# EAGLE design Shruthi-Digital-v07 (EAGLE 5.11)
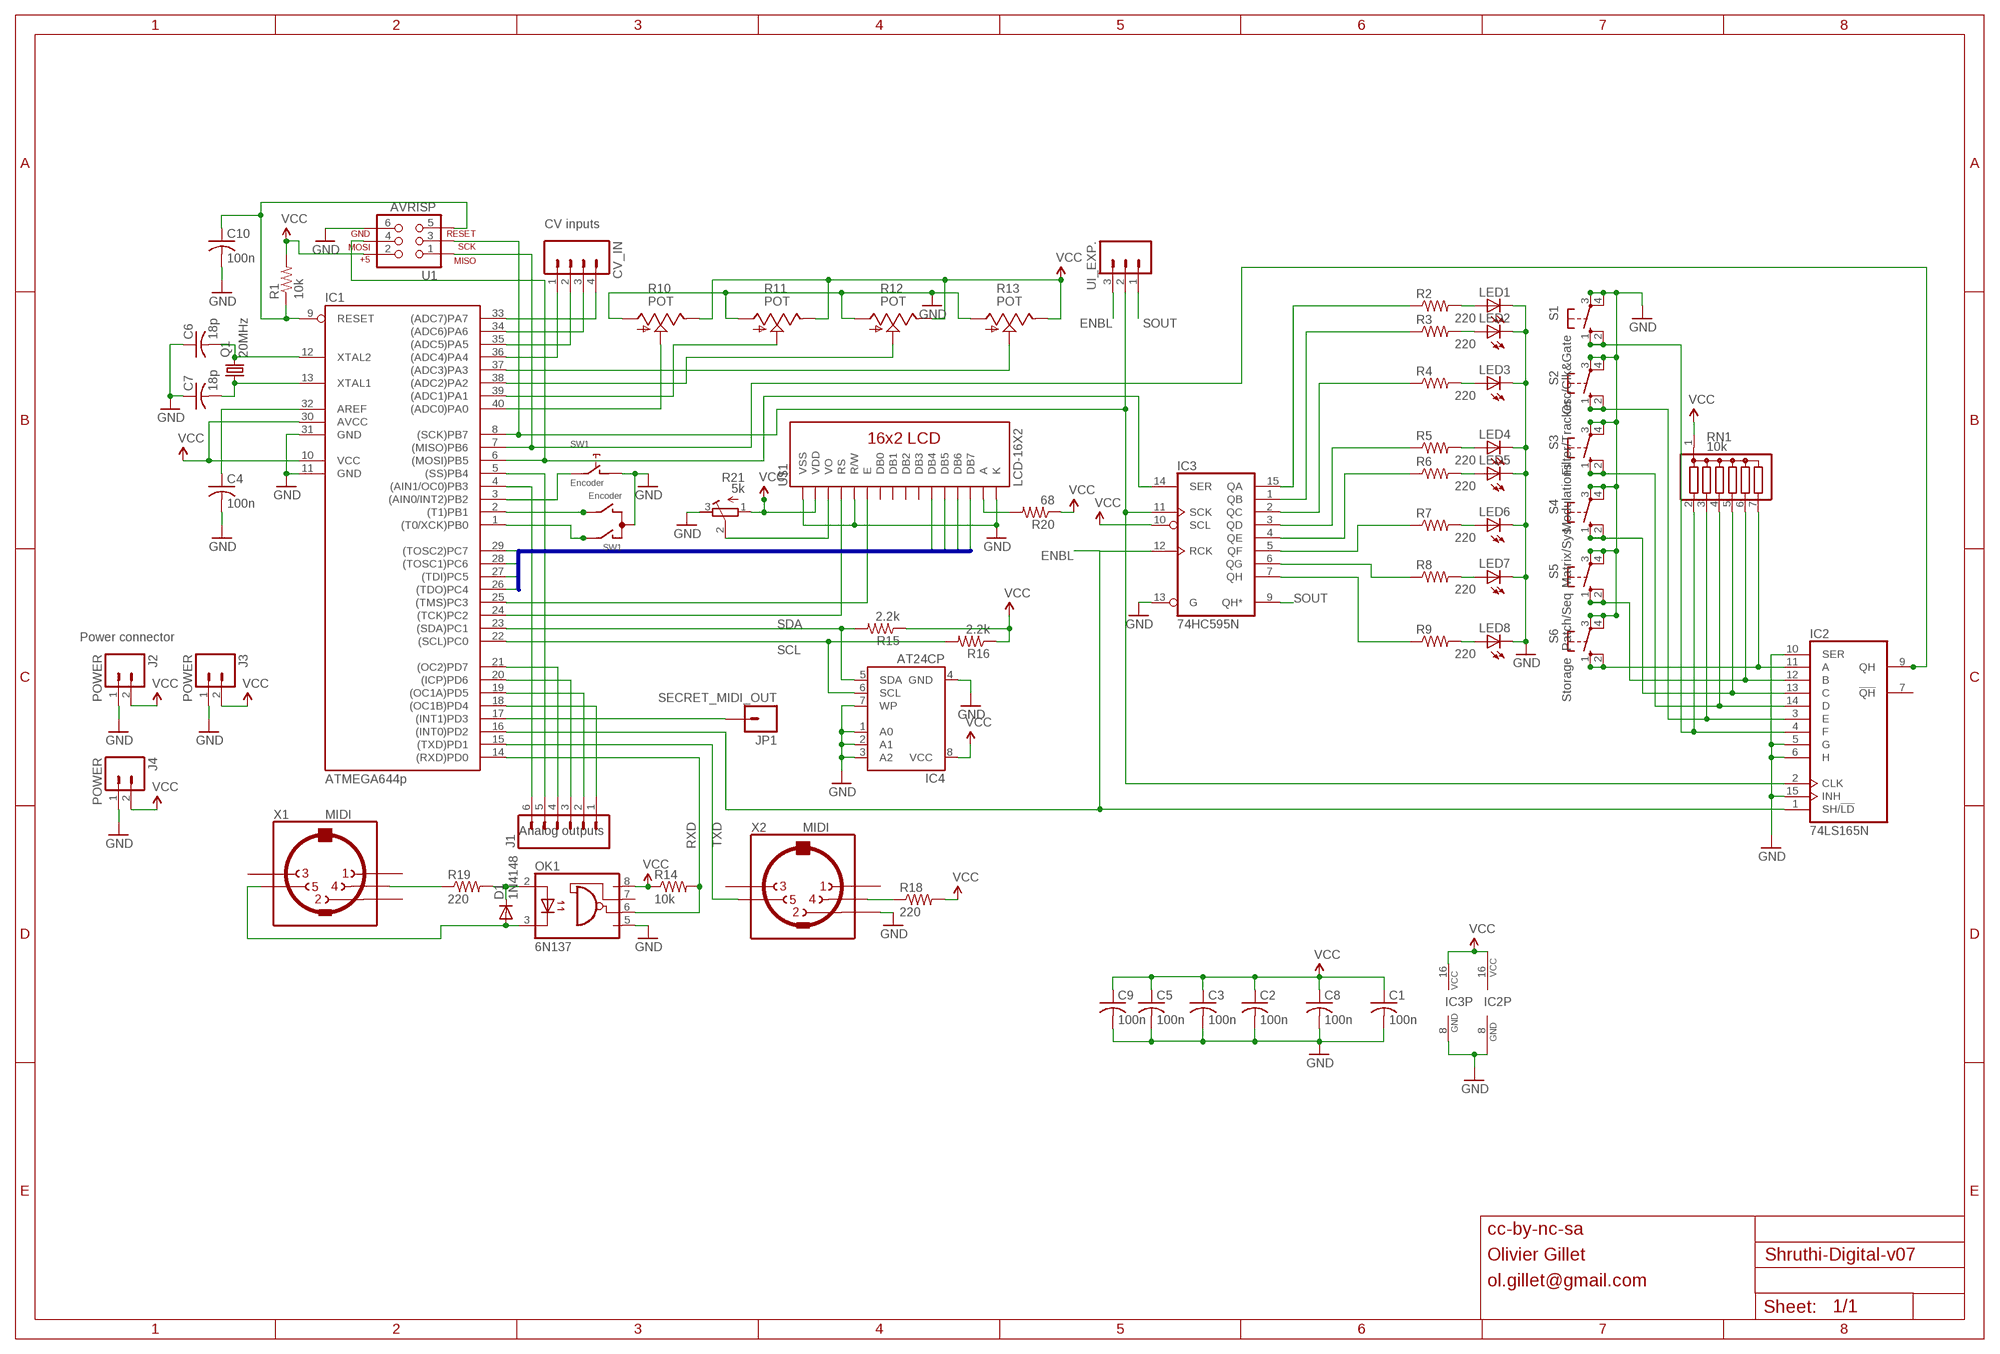
[diagram p0: schematic, sheet 1]

## Parts
C1  100n  C-US025-024X044  [C025-024X044]
C2  100n  C-US025-024X044  [C025-024X044]
C3  100n  C-US025-024X044  [C025-024X044]
C4  100n  C-US025-024X044  [C025-024X044]
C5  100n  C-US025-024X044  [C025-024X044]
C6  18p  C-US025-024X044  [C025-024X044]
C7  18p  C-US025-024X044  [C025-024X044]
C8  100n  C-US025-024X044  [C025-024X044]
C9  100n  C-US025-024X044  [C025-024X044]
C10  100n  C-US025-024X044  [C025-024X044]
CV_IN  M04PTH  [1X04]
D1  1N4148  DIODE-D-5  [D-5]
IC1  ATMEGA644p  MEGA16-P  [DIL40]
IC2  74LS165N  [DIL16]
IC3  74HC595N  [DIL16]
IC4  AT24CP  [DIL08]
J1  M06SIP  [1X06]
J2  POWER  M02PTH  [1X02]
J3  POWER  M02PTH  [1X02]
J4  POWER  M02PTH  [1X02]
JP1  SECRET_MIDI_OUT  M01PTH  [1X01]
LED1  LED3MM  [LED3MM]
LED2  LED3MM  [LED3MM]
LED3  LED3MM  [LED3MM]
LED4  LED3MM  [LED3MM]
LED5  LED3MM  [LED3MM]
LED6  LED3MM  [LED3MM]
LED7  LED3MM  [LED3MM]
LED8  LED3MM  [LED3MM]
OK1  6N137  [DIL08]
Q1  20MHz  CRYSTALHC49U-V  [HC49U-V]
R1  10k  R-US_0204/7  [0204/7]
R2  220  R-US_0204/7  [0204/7]
R3  220  R-US_0204/7  [0204/7]
R4  220  R-US_0204/7  [0204/7]
R5  220  R-US_0204/7  [0204/7]
R6  220  R-US_0204/7  [0204/7]
R7  220  R-US_0204/7  [0204/7]
R8  220  R-US_0204/7  [0204/7]
R9  220  R-US_0204/7  [0204/7]
R10  POT  POT_US  [ALPS_POT_SFE]
R11  POT  POT_US  [ALPS_POT_SFE]
R12  POT  POT_US  [ALPS_POT_SFE]
R13  POT  POT_US  [ALPS_POT_SFE]
R14  10k  R-US_0204/7  [0204/7]
R15  2.2k  R-US_0204/7  [0204/7]
R16  2.2k  R-US_0204/7  [0204/7]
R18  220  R-US_0204/7  [0204/7]
R19  220  R-US_0204/7  [0204/7]
R20  68  R-US_0204/7  [0204/7]
R21  5k  R-TRIMM3296W  [RTRIM3296W]
RN1  10k  G06R  [SIL7]
S1  Osc/Clk&Gate  40-XX  [B3F-40XX]
S2  Filter/Tracker  40-XX  [B3F-40XX]
S3  Modulations  40-XX  [B3F-40XX]
S4  Matrix/Sys  40-XX  [B3F-40XX]
S5  Patch/Seq  40-XX  [B3F-40XX]
S6  Storage  40-XX  [B3F-40XX]
SW1  Encoder  EC12E_SW  [ALPS_EC12E_SW]
U1  AVRISP  AVR_SPI_PRG_6PTH  [2X3]
U$1  LCD-16X2  [LCD-16X2]
UI_EXP.  M03PTH  [1X03]
X1  MIDI  MAB5SH  [MAB5SH]
X2  MIDI  MAB5SH  [MAB5SH]

## Nets
ENBL: IC1.16((INT0)PD2) IC2.1(SH/!LD) IC3.12(RCK) UI_EXP..3
GND: C1.2 C2.2 C3.2 C4.2 C5.2 C6.1 C7.1 C8.2 C9.2 C10.2 IC1.11(GND) IC1.31(GND) IC2.5(G) IC2.6(H) IC2.8(GND) IC2.10(SER) IC2.15(INH) IC3.8(GND) IC3.13(G) IC4.1(A0) IC4.2(A1) IC4.3(A2) IC4.4(GND) IC4.7(WP) J2.1 J3.1 J4.1 LED1.K(C) LED2.K(C) LED3.K(C) LED4.K(C) LED5.K(C) LED6.K(C) LED7.K(C) LED8.K(C) OK1.5(GND) R10.P$3(A) R11.P$3(A) R12.P$3(A) R13.P$3(A) R21.3(A) S1.3(P) S1.4(P1) S2.3(P) S2.4(P1) S3.3(P) S3.4(P1) S4.3(P) S4.4(P1) S5.3(P) S5.4(P1) S6.3(P) S6.4(P1) SW1.C SW1.D U1.6 U$1.1(VSS) U$1.5(R/W) U$1.16(K) X2.2
LCD_DATA1: IC1.26((TDO)PC4) U$1.11(DB4)
LCD_DATA2: IC1.27((TDI)PC5) U$1.12(DB5)
LCD_DATA3: IC1.28((TOSC1)PC6) U$1.13(DB6)
LCD_DATA4: IC1.29((TOSC2)PC7) U$1.14(DB7)
N$1: IC3.2(QC) R4.1
N$2: IC1.24((TCK)PC2) U$1.4(RS)
N$3: IC2.11(A) RN1.7 S6.1(S) S6.2(S1)
N$5: IC2.3(E) RN1.3 S2.1(S) S2.2(S1)
N$6: C10.1 IC1.9(RESET) R1.1 U1.5
N$7: C4.1 IC1.32(AREF)
N$8: IC1.8((SCK)PB7) IC2.2(CLK) IC3.11(SCK) U1.3 UI_EXP..2
N$9: IC1.7((MISO)PB6) IC2.9(QH) U1.1
N$10: CV_IN.1 IC1.36((ADC4)PA4)
N$11: CV_IN.2 IC1.35((ADC5)PA5)
N$12: CV_IN.3 IC1.34((ADC6)PA6)
N$13: CV_IN.4 IC1.33((ADC7)PA7)
N$14: IC1.40((ADC0)PA0) R10.P$2(S)
N$15: IC1.39((ADC1)PA1) R11.P$2(S)
N$16: IC1.38((ADC2)PA2) R12.P$2(S)
N$17: IC1.37((ADC3)PA3) R13.P$2(S)
N$18: IC1.4((AIN1/OC0)PB3) J1.6
N$19: IC1.5((SS)PB4) J1.5
N$20: IC1.18((OC1B)PD4) J1.1
N$21: IC1.19((OC1A)PD5) J1.2
N$22: IC1.20((ICP)PD6) J1.3
N$23: IC1.21((OC2)PD7) J1.4
N$25: IC1.17((INT1)PD3) JP1.1
N$28: D1.C OK1.2(A) R19.2
N$30: IC3.15(QA) R2.1
N$31: IC3.1(QB) R3.1
N$33: IC3.3(QD) R5.1
N$34: IC3.4(QE) R6.1
N$35: IC3.5(QF) R7.1
N$36: IC3.7(QH) R9.1
N$37: IC3.6(QG) R8.1
N$42: LED1.A R2.2
N$43: LED2.A R3.2
N$44: LED3.A R4.2
N$45: LED4.A R5.2
N$46: LED5.A R6.2
N$47: LED6.A R7.2
N$48: LED7.A R8.2
N$49: LED8.A R9.2
N$57: IC1.6((MOSI)PB5) IC3.14(SER) U1.4
N$59: IC2.4(F) RN1.2 S1.1(S) S1.2(S1)
N$61: IC2.14(D) RN1.4 S3.1(S) S3.2(S1)
N$62: IC2.13(C) RN1.5 S4.1(S) S4.2(S1)
N$63: IC2.12(B) RN1.6 S5.1(S) S5.2(S1)
N$64: IC1.1((T0/XCK)PB0) SW1.A
N$65: IC1.2((T1)PB1) SW1.B
N$66: IC1.3((AIN0/INT2)PB2) SW1.E
N$68: R18.1 X2.4
N$72: R19.1 X1.4
N$73: D1.A OK1.3(C) X1.5
N$76: IC1.25((TMS)PC3) U$1.6(E)
N$78: R21.2(S) U$1.3(VO)
N$79: R20.2 U$1.15(A)
N$82: C7.2 IC1.13(XTAL1) Q1.1
N$83: C6.2 IC1.12(XTAL2) Q1.2
RXD: IC1.14((RXD)PD0) OK1.6(VO) R14.2
SCL: IC1.22((SCL)PC0) IC4.6(SCL) R16.2
SDA: IC1.23((SDA)PC1) IC4.5(SDA) R15.2
SOUT: IC3.9(QH*) UI_EXP..1
TXD: IC1.15((TXD)PD1) X2.5
VCC: C1.1 C2.1 C3.1 C5.1 C8.1 C9.1 IC1.10(VCC) IC1.30(AVCC) IC2.16(VCC) IC3.10(SCL) IC3.16(VCC) IC4.8(VCC) J2.2 J3.2 J4.2 OK1.8(VCC) R1.2 R10.P$1(E) R11.P$1(E) R12.P$1(E) R13.P$1(E) R14.1 R15.1 R16.1 R18.2 R20.1 R21.1(E) RN1.1 U1.2 U$1.2(VDD)
Unconnected: IC2.7(!QH) OK1.7(VE) SW1.GND1(G) SW1.GND2(G) U$1.7(DB0) U$1.8(DB1) U$1.9(DB2) U$1.10(DB3) X1.1 X1.2 X1.3 X2.1 X2.3

## Buses
LCD_DATA[1..4]

## Notes on the sheet
- CV inputs
- Power connector
- Analog outputs
- cc-by-nc-sa
- Olivier Gillet
- ol.gillet@gmail.com

## Library data of the parts
C1-C10 = rcl:C-US: CAPACITOR, American symbol
CV_IN = SparkFun:M04: Header 4 Standard 4-pin 0.1" header. Use with straight break away headers (SKU : PRT-00116), right angle break away headers (PRT-00553), swiss pins (PRT-00743), machine pins (PRT-00117), and female headers (PRT-00115). Molex polarized connector foot print use with SKU : PRT-08231 with associated crimp pins and housings.
D1 = diode:DIODE-: DIODE
IC1 = atmel:MEGA16-P: MICROCONTROLLER 16 Kbytes FLASH 1 kbytes SRAM 512 bytes EEPROM USART 8-channel 10 bit ADC Source: avr.lbr
IC2 = 74xx-us:74*165: 8-bit parallel load SHIFT REGISTER
IC3 = 74xx-eu:74*595: 8-bit SHIFT REGISTER, output latch
IC4 = atmel:AT24C*: 2-wire serial EEPROM
J1 = SparkFun:M06: Header 6 Standard 6-pin 0.1" header. Use with straight break away headers (SKU : PRT-00116), right angle break away headers (PRT-00553), swiss pins (PRT-00743), machine pins (PRT-00117), and female headers (PRT-00115). Molex polarized connector foot print use with SKU : PRT-08094 with associated crimp pins and housings. NOTES ON THE VARIANTS LOCK and LOCK_LONGPADS... This footprint was designed to help hold the alignment of a through-hole component (i.e. 6-pin header) while soldering it into place. You may notice that each hole has been shifted either up or down by 0.005 of an inch from it's more standard position (which is a perfectly straight line). This slight alteration caused the pins (the squares in the middle) to touch the edges of the holes. Because they are alternating, it causes a "brace" to hold the component in place. 0.005 has proven to be the perfect amount of "off-center" position when using our standard breakaway headers. Although looks a little odd when you look at the bare footprint, once you have a header in there, the alteration is very hard to notice. Also, if you push a header all the way into place, it is covered up entirely on the bottom side. This idea of altering the position of holes to aid alignment will be further integrated into the Sparkfun Library for other footprints. It can help hold any component with 3 or more connection pins.
J2-J4 = SparkFun:M02: Header 2 Standard 2-pin 0.1" header. Use with straight break away headers (SKU : PRT-00116), right angle break away headers (PRT-00553), swiss pins (PRT-00743), machine pins (PRT-00117), and female headers (PRT-00115). Molex polarized connector foot print use with SKU : PRT-08233 with associated crimp pins and housings.
JP1 = SparkFun:M01: Header 1 Standard 1-pin 0.1" header. Use with straight break away headers (SKU : PRT-00116), right angle break away headers (PRT-00553), swiss pins (PRT-00743), machine pins (PRT-00117), and female headers (PRT-00115).
LED1-LED8 = led:LED: LED OSRAM: - CHIPLED LG R971, LG N971, LY N971, LG Q971, LY Q971, LO R971, LY R971 LH N974, LH R974 LS Q976, LO Q976, LY Q976 LO Q996 - Hyper CHIPLED LW Q18S LB Q993, LB Q99A, LB R99A - SideLED LS A670, LO A670, LY A670, LG A670, LP A670 LB A673, LV A673, LT A673, LW A673 LH A674 LY A675 LS A676, LA A676, LO A676, LY A676, LW A676 LS A679, LY A679, LG A679 - Hyper Micro SIDELED® LS Y876, LA Y876, LO Y876, LY Y876 LT Y87S - SmartLED LW L88C, LW L88S LB L89C, LB L89S, LG L890 LS L89K, LO L89K, LY L89K LS L896, LA L896, LO L896, LY L896 - TOPLED LS T670, LO T670, LY T670, LG T670, LP T670 LSG T670, LSP T670, LSY T670, LOP T670, LYG T670 LG T671, LOG T671, LSG T671 LB T673, LV T673, LT T673, LW T673 LH T674 LS T676, LA T676, LO T676, LY T676, LB T676, LH T676, LSB T676, LW T676 LB T67C, LV T67C, LT T67C, LS T67K, LO T67K, LY T67K, LW E67C LS E67B, LA E67B, LO E67B, LY E67B, LB E67C, LV E67C, LT E67C LW T67C LS T679, LY T679, LG T679 LS T770, LO T770, LY T770, LG T770, LP T770 LB T773, LV T773, LT T773, LW T773 LH T774 LS E675, LA E675, LY E675, LS T675 LS T776, LA T776, LO T776, LY T776, LB T776 LHGB T686 LT T68C, LB T68C - Hyper Mini TOPLED® LB M676 - Mini TOPLED Santana® LG M470 LS M47K, LO M47K, LY M47K Source: http://www.osram.convergy.de LUXEON: - LUMILED® LXK2-PW12-R00, LXK2-PW12-S00, LXK2-PW14-U00, LXK2-PW14-V00 LXK2-PM12-R00, LXK2-PM12-S00, LXK2-PM14-U00 LXK2-PE12-Q00, LXK2-PE12-R00, LXK2-PE12-S00, LXK2-PE14-T00, LXK2-PE14-U00 LXK2-PB12-K00, LXK2-PB12-L00, LXK2-PB12-M00, LXK2-PB14-N00, LXK2-PB14-P00, LXK2-PB14-Q00 LXK2-PR12-L00, LXK2-PR12-M00, LXK2-PR14-Q00, LXK2-PR14-R00 LXK2-PD12-Q00, LXK2-PD12-R00, LXK2-PD12-S00 LXK2-PH12-R00, LXK2-PH12-S00 LXK2-PL12-P00, LXK2-PL12-Q00, LXK2-PL12-R00 Source: www.luxeon.com KINGBRIGHT: KA-3528ASYC Source: www.kingbright.com
OK1 = optocoupler:6N137: MOTOROLA OPTO COUPLER
Q1 = crystal:CRYSTAL: CRYSTAL
R1-R9 R14-R16 R18-R20 = rcl:R-US_: RESISTOR, American symbol
R10-R13 = pot-alps:POT_US
R21 = rcl:R-TRIMM: Trimm resistor
RN1 = resistor-sil:G06R: SIL RESISTOR
S1-S6 = og-switch:40-XX: OMRON SWITCH
SW1 = switch-alps:EC12E_SW: ALPS rotary Encoder EC12E series with switch
U1 = SparkFun:AVR_SPI_PRG_6: AVR ISP 6 Pin This is the reduced ISP connector for AVR programming. Common on Arduino. This footprint will take up less PCB space and can be used with a 10-pin to 6-pin adapter such as SKU: BOB-08508
U$1 = SparkFun:LCD-16X2
UI_EXP. = SparkFun:M03: Header 3 Standard 3-pin 0.1" header. Use with straight break away headers (SKU : PRT-00116), right angle break away headers (PRT-00553), swiss pins (PRT-00743), machine pins (PRT-00117), and female headers (PRT-00115). Molex polarized connector foot print use with SKU : PRT-08232 with associated crimp pins and housings.
X1 X2 = og-midi:MAB5SH: Female CONNECTOR 5 pins 90 deg. with shield, horizontal (DIN 41524)

## Board
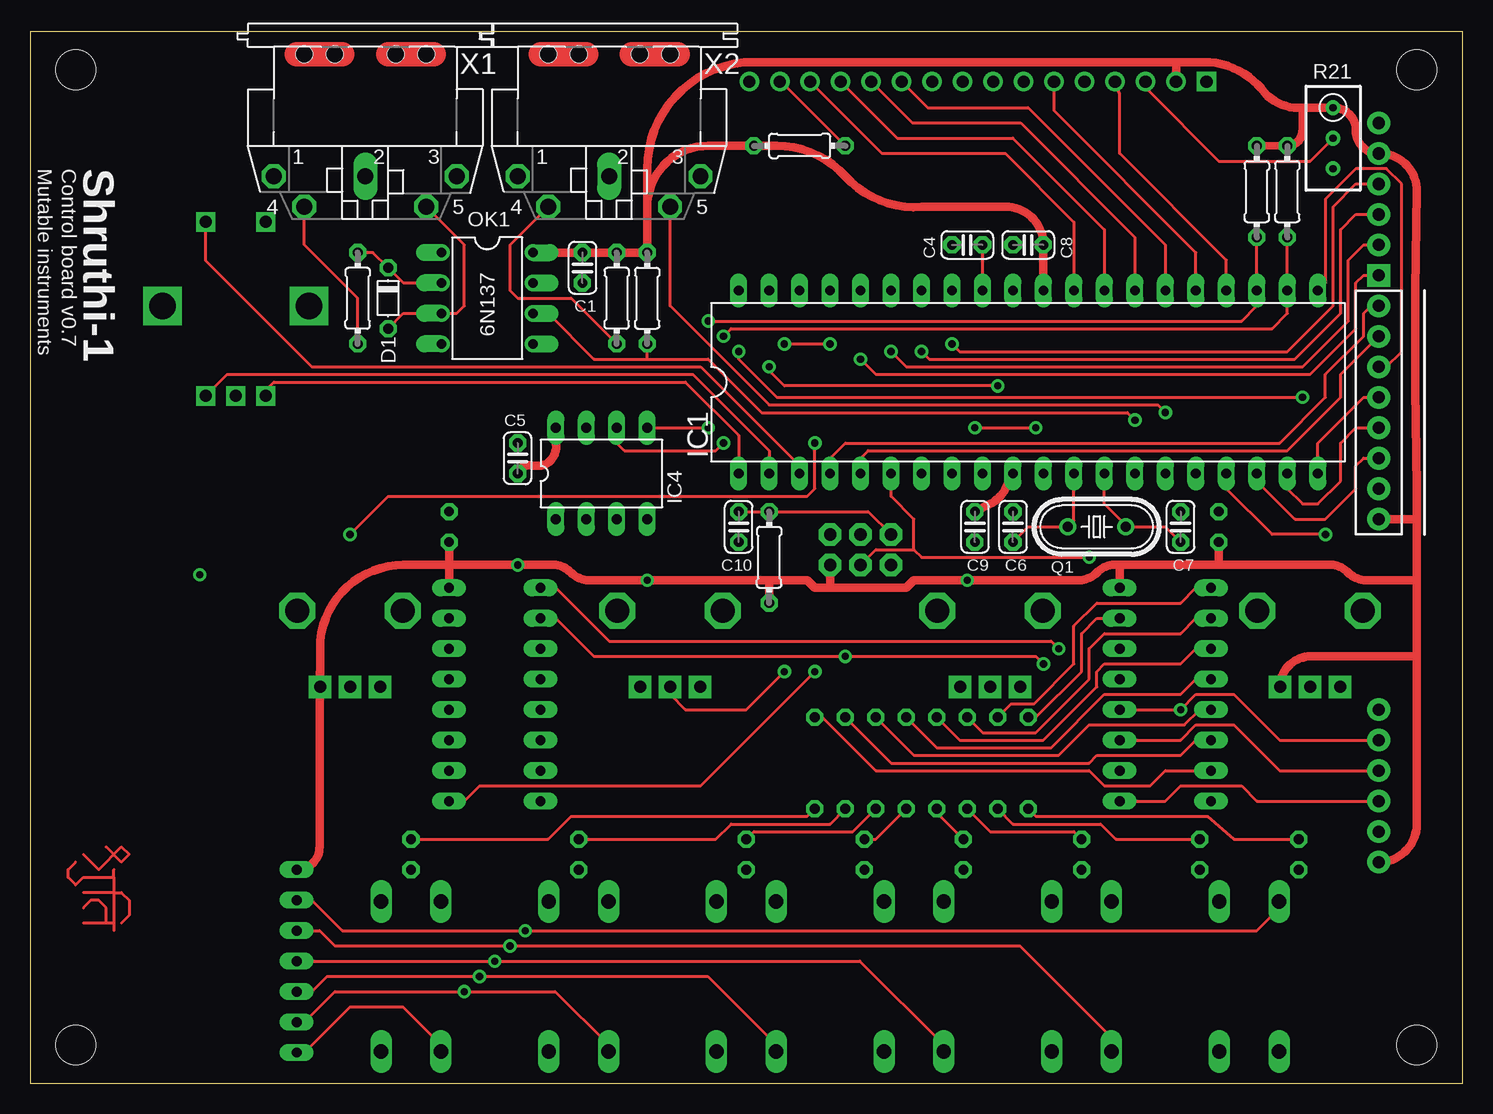
[diagram p1: board, top side]
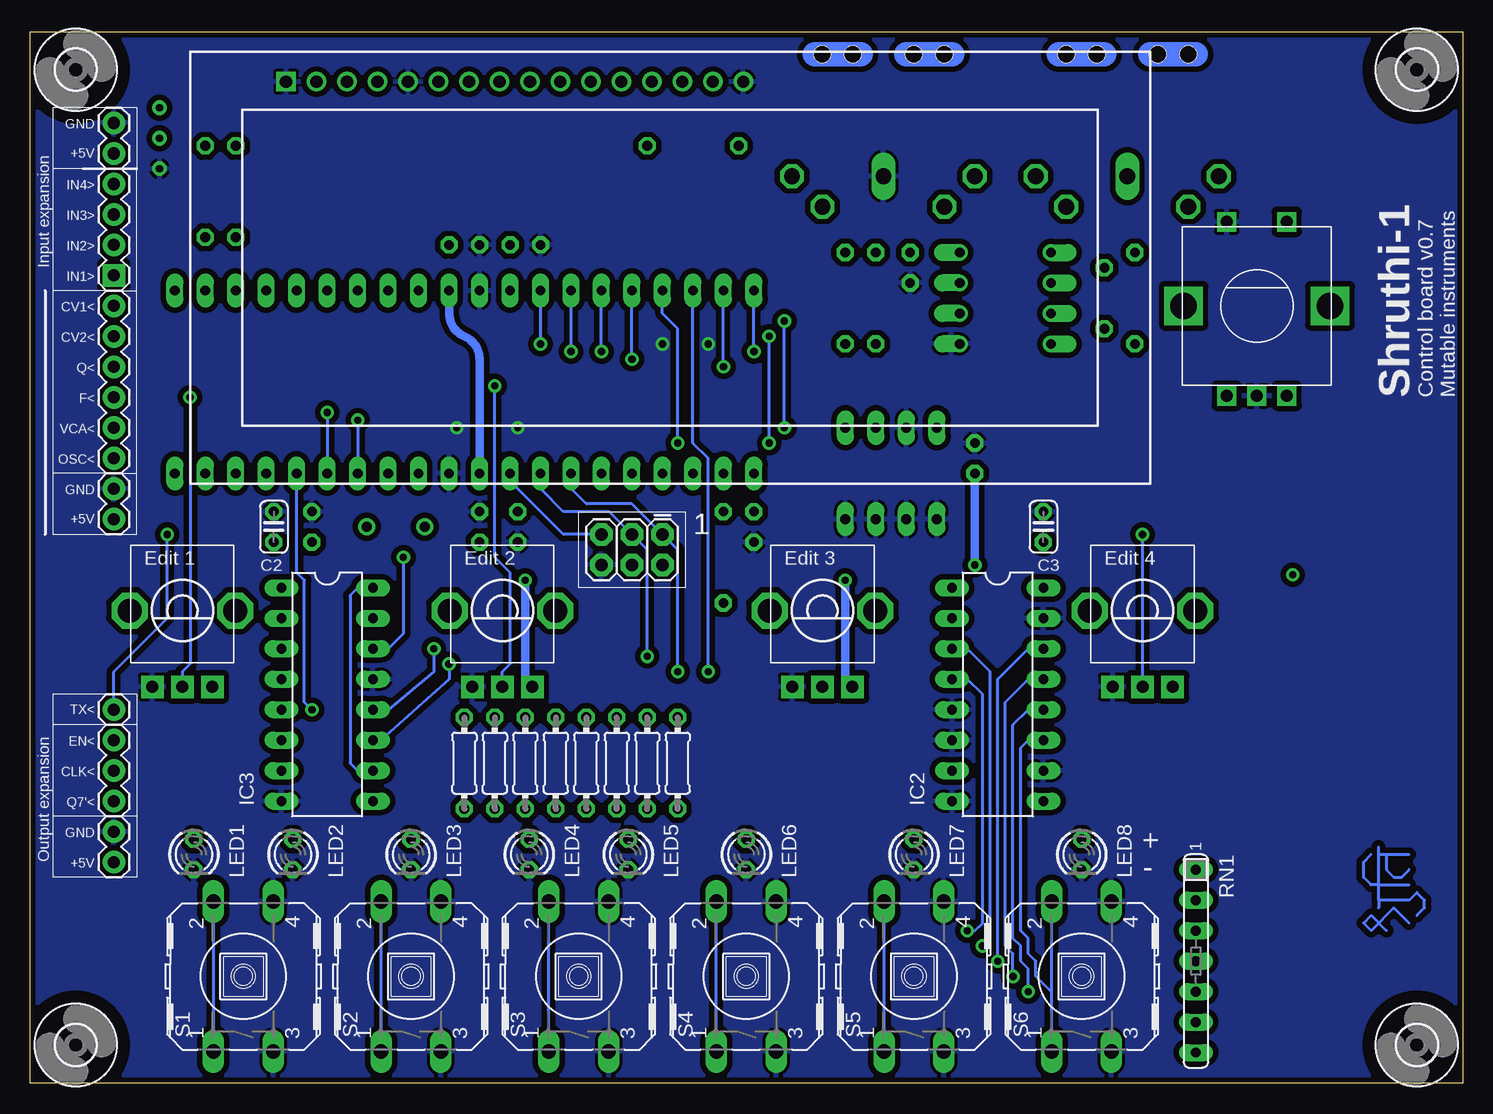
[diagram p2: board, bottom side, seen from below]

Size 119.38 x 87.63 mm. Coordinates in mm from the lower left corner, seen from the top.
Outline: 0,0 119.38,0 119.38,87.63 0,87.62 0,0
Copper layers (1*16): Top 0.035mm / dielectric 1.5mm / Bottom 0.035mm
Design rules "SparkFun *": minimum track width 8mil, minimum drill 20mil, track to track 8mil, track to pad 8mil, pad to pad 8mil, via to via 8mil, smd to smd 8mil, copper to edge 10mil, drill to drill 8mil, minimum pad ring 12mil, minimum via ring 10mil, stop-mask expansion 4mil, vias tented up to drill 25mil, thermal gap 10mil

### Footprints (pad centres in the part's own frame; a part is rotated, then mirrored left to right if it is on the bottom)
C025-024X044 = drill 0.813 octagon: 1 -1.27,0; 2 1.27,0
1X04 = drill 1.016 pad 1.88 square: 1 0,0 | drill 1.016 pad 1.88 round: 2 2.54,0; 3 5.08,0; 4 7.62,0
D-5 = drill 0.813 octagon: A 2.54,0; C -2.54,0
DIL40 = drill 0.813 long: 1 -24.13,-7.62; 2 -21.59,-7.62; 3 -19.05,-7.62; 4 -16.51,-7.62; 5 -13.97,-7.62; 6 -11.43,-7.62; 7 -8.89,-7.62; 8 -6.35,-7.62; 9 -3.81,-7.62; 10 -1.27,-7.62; 11 1.27,-7.62; 12 3.81,-7.62; 13 6.35,-7.62; 14 8.89,-7.62; 15 11.43,-7.62; 16 13.97,-7.62; 17 16.51,-7.62; 18 19.05,-7.62; 19 21.59,-7.62; 20 24.13,-7.62; 21 24.13,7.62; 22 21.59,7.62; 23 19.05,7.62; 24 16.51,7.62; 25 13.97,7.62; 26 11.43,7.62; 27 8.89,7.62; 28 6.35,7.62; 29 3.81,7.62; 30 1.27,7.62; 31 -1.27,7.62; 32 -3.81,7.62; 33 -6.35,7.62; 34 -8.89,7.62; 35 -11.43,7.62; 36 -13.97,7.62; 37 -16.51,7.62; 38 -19.05,7.62; 39 -21.59,7.62; 40 -24.13,7.62
DIL16 = drill 0.813 long: 1 -8.89,-3.81; 2 -6.35,-3.81; 3 -3.81,-3.81; 4 -1.27,-3.81; 5 1.27,-3.81; 6 3.81,-3.81; 7 6.35,-3.81; 8 8.89,-3.81; 9 8.89,3.81; 10 6.35,3.81; 11 3.81,3.81; 12 1.27,3.81; 13 -1.27,3.81; 14 -3.81,3.81; 15 -6.35,3.81; 16 -8.89,3.81
DIL08 = drill 0.813 long: 1 -3.81,-3.81; 2 -1.27,-3.81; 3 1.27,-3.81; 4 3.81,-3.81; 5 3.81,3.81; 6 1.27,3.81; 7 -1.27,3.81; 8 -3.81,3.81
1X06 = drill 1.016 pad 1.88 round: 1 0,0; 2 2.54,0; 3 5.08,0; 4 7.62,0; 5 10.16,0; 6 12.7,0
1X02 = drill 1.016 pad 1.88 round: 1 0,0; 2 2.54,0
1X01 = drill 1.016 pad 1.88 round: 1 0,0
LED3MM = drill 0.813 octagon: A -1.27,0; K 1.27,0
DIL08' = drill 0.813 offset: 1 -3.81,-3.81; 2 -1.27,-3.81; 3 1.27,-3.81; 4 3.81,-3.81; 5 3.81,3.81; 6 1.27,3.81; 7 -1.27,3.81; 8 -3.81,3.81
HC49U-V = drill 0.813 round: 1 -2.413,0; 2 2.413,0
0204/7 = drill 0.813 octagon: 1 -3.81,0; 2 3.81,0
ALPS_POT_SFE = drill 1 pad 1.88 square: P$1 -2.5,6.35; P$2 0,6.35; P$3 2.5,6.35 | drill 2 octagon: P$4 -4.4,0; P$5 4.4,0
RTRIM3296W = drill 0.61 round: 1 0,-2.54; 2 0,0; 3 0,2.54
SIL7 = drill 0.813 long: 1 -7.62,0; 2 -5.08,0; 3 -2.54,0; 4 0,0; 5 2.54,0; 6 5.08,0; 7 7.62,0
B3F-40XX = drill 1.194 long: 1 -6.248,2.489; 2 6.248,2.489; 3 -6.248,-2.489; 4 6.248,-2.489
ALPS_EC12E_SW = drill 1 square: A -2.5,-7.5; B 2.5,-7.5; C 0,-7.5; D -2.5,7; E 2.5,7 | drill 2.2 square: GND1 -6.1,0; GND2 6.1,0
2X3 = drill 1.016 pad 1.88 octagon: 1 0,0; 2 0,2.54; 3 2.54,0; 4 2.54,2.54; 5 5.08,0; 6 5.08,2.54
LCD-16X2 = drill 1.016 square: 1 -32,15.5 | drill 1.016 round: 2 -29.46,15.5; 3 -26.92,15.5; 4 -24.38,15.5; 5 -21.84,15.5; 6 -19.3,15.5; 7 -16.76,15.5; 8 -14.22,15.5; 9 -11.68,15.5; 10 -9.14,15.5; 11 -6.6,15.5; 12 -4.06,15.5; 13 -1.52,15.5; 14 1.02,15.5; 15 3.56,15.5; 16 6.1,15.5
3,3 = hole 3.3: 0,0
1X03 = drill 1.016 pad 1.88 round: 1 0,0; 2 2.54,0; 3 5.08,0
MAB5SH = drill 1.321 octagon: 1 7.62,7.62; 3 -7.62,7.62; 4 5.08,10.16; 5 -5.08,10.16 | drill 1.321 long: 2 0,7.62 | hole 1.4: 2.54,-2.54; -2.54,-2.54; -5.08,-2.54; 5.08,-2.54

### Placement (x,y rotation side)
C1  46.04,67.95 270 top
C2  99.06,46.35 90 bottom
C3  34.92,46.35 90 bottom
C4  78.11,69.85 180 top
C5  40.64,52.07 90 top
C6  81.92,46.35 270 top
C7  95.89,46.35 270 top
C8  83.19,69.85 180 top
C9  78.74,46.35 270 top
C10  59.05,46.35 270 top
CV_IN  112.39,67.31 90 bottom
D1  29.84,65.41 270 top
IC1  83.19,58.42 0 top
IC2  38.73,32.38 270 bottom
IC3  94.61,32.38 270 bottom
IC4  47.62,50.8 0 top
J1  112.39,52.07 90 bottom
J2  112.39,49.53 270 bottom
J3  112.39,80.01 270 bottom
J4  112.39,20.95 270 bottom
JP1  112.39,31.11 90 bottom
LED1  105.73,19.05 270 bottom
LED2  97.47,19.05 270 bottom
LED3  87.63,19.05 270 bottom
LED4  77.79,19.05 270 bottom
LED5  69.53,19.05 270 bottom
LED6  59.69,19.05 270 bottom
LED7  45.72,19.05 270 bottom
LED8  31.75,19.05 270 bottom
OK1  6N137  [DIL08']  38.1,65.41 270 top
Q1  88.9,46.35 180 top
R1  61.59,43.81 270 top
R2  83.19,26.67 270 bottom
R3  80.64,26.67 270 bottom
R4  78.11,26.67 270 bottom
R5  75.56,26.67 270 bottom
R6  73.02,26.67 270 bottom
R7  70.48,26.67 270 bottom
R8  67.94,26.67 270 bottom
R9  65.41,26.67 270 bottom
R10  106.68,39.37 180 bottom
R11  80.01,39.37 180 bottom
R12  53.34,39.37 180 bottom
R13  26.67,39.37 180 bottom
R14  51.44,65.41 270 top
R15  102.23,74.3 270 top
R16  104.78,74.3 270 top
R18  48.9,65.41 90 top
R19  27.3,65.41 90 top
R20  64.14,78.11 0 top
R21  108.59,78.74 180 top
RN1  22.23,10.16 270 bottom
S1  101.6,8.89 90 bottom
S2  87.63,8.89 90 bottom
S3  73.66,8.89 90 bottom
S4  59.69,8.89 90 bottom
S5  45.72,8.89 90 bottom
S6  31.75,8.89 90 bottom
SW1  17.14,64.77 0 bottom
U1  66.67,45.72 180 bottom
U$1  66.04,67.95 0 bottom
U$2  [3,3]  115.57,84.46 0 bottom
U$3  [3,3]  115.57,3.17 0 bottom
U$4  [3,3]  3.81,3.17 0 bottom
U$5  [3,3]  3.81,84.46 0 bottom
UI_EXP.  112.39,23.49 90 bottom
X1  27.94,83.19 180 top
X2  48.26,83.19 180 top

### Tracks (layer width: path | path; a pad name or v marks a point on that pad's centre or on a via)
ENBL  (via drill 0.6)
  Top 0.254: IC3.12 v95.89,31.11 97.16,32.38 100.33,32.38 104.14,28.57 UI_EXP..3 | IC2.1 43.82,41.27 48.26,36.83 85.09,36.83 v85.73,36.2
  Bottom 0.254: v95.89,31.11 96.52,31.75 96.52,41.91 97.16,42.55 IC1.16 | v85.73,36.2 85.73,34.29 89.53,31.11 IC3.12
GND  (via drill 0.6)
  Top 0.254: v62.87,61.59 v66.67,61.59 | v78.74,54.61 v83.82,54.61
  pour Bottom (isolate 0.457): 0.63,87 0.63,0.64 118.75,0.64 118.75,87
LCD_DATA1
  Top 0.254: U$1.11 74.81,81.28 83.19,81.28 94.61,69.85 IC1.26
LCD_DATA2
  Top 0.254: U$1.12 73.53,80.01 82.55,80.01 92.08,70.48 IC1.27
LCD_DATA3
  Top 0.254: U$1.13 72.27,78.74 81.92,78.74 89.53,71.12 IC1.28
LCD_DATA4
  Top 0.254: U$1.14 71,77.47 81.28,77.47 87,71.76 IC1.29
N$1
  Top 0.254: R4.1 79.38,29.21 83.82,29.21 88.27,33.66 88.27,36.2 89.53,37.46 95.89,37.46 97.16,38.73 IC3.2
N$2
  Top 0.254: IC1.24 99.7,68.58 90.81,77.47 90.81,82.43 U$1.4
N$3
  Top 0.254: S6.1 34.24,3.17 31.06,6.35 26.67,6.35 22.86,2.54 RN1.7
  Bottom 0.254: S6.1 34.24,7.62 | 34.24,7.62 S6.2 34.24,15.19 | IC2.11 36.2,28.57 36.83,27.94 36.83,12.7 36.2,12.07 36.2,10.8 35.56,10.16 35.56,8.89 34.29,7.62 34.24,7.62
N$4
  Top 0.254: 4.45,19.05 5.71,17.78 7.62,19.68 8.25,19.05 7.62,18.41 6.35,19.68
N$5  (via drill 0.6)
  Top 0.254: S2.1 90.12,3.81 82.5,11.43 v40.01,11.43 25.4,11.43 24.13,12.7 RN1.3
  Bottom 0.254: S2.1 S2.2 | IC2.3 41.27,36.2 39.37,34.29 39.37,12.07 v40.01,11.43
N$6
  Top 0.254: U1.5 69.85,47.62 R1.1 C10.1
  Bottom 0.254: U1.5 74.93,45.72 79.38,50.16 IC1.9
N$7
  Top 0.254: IC1.32 C4.1
N$8  (via drill 0.6)
  Top 0.254: v84.45,34.92 83.82,35.56 v67.94,35.56 46.99,35.56 43.82,38.73 IC2.2 | IC3.11 95.89,28.57 97.16,29.84 100.33,29.84 104.14,26.04 UI_EXP..2
  Bottom 0.254: IC3.11 90.17,28.57 84.45,33.66 v84.45,34.92 | IC1.8 76.84,49.53 74.93,47.62 71.12,47.62 U1.3 67.94,44.45 v67.94,35.56
N$9  (via drill 0.6)
  Top 0.254: v65.41,34.29 55.88,24.77 37.47,24.77 36.2,23.49 IC2.9
  Bottom 0.254: v65.41,34.29 65.41,44.45 U1.1 69.22,48.26 73.02,48.26 74.3,49.53 IC1.7
N$10  (via drill 0.6)
  Top 0.254: CV_IN.1 111.12,67.31 110.49,66.68 110.49,62.87 106.68,59.05 70.48,59.05 v69.22,60.32
  Bottom 0.254: v69.22,60.32 IC1.36
N$11  (via drill 0.6)
  Top 0.254: CV_IN.2 111.12,69.85 109.86,68.58 109.86,63.5 106.05,59.69 73.02,59.69 v71.75,60.96
  Bottom 0.254: v71.75,60.96 IC1.35
N$12  (via drill 0.6)
  Top 0.254: CV_IN.3 110.49,72.39 109.22,71.12 109.22,64.14 105.41,60.32 74.93,60.32 v74.3,60.96
  Bottom 0.254: v74.3,60.96 IC1.34
N$13  (via drill 0.6)
  Top 0.254: CV_IN.4 110.49,74.93 108.59,73.03 108.59,64.77 104.78,60.96 77.47,60.96 v76.84,61.59
  Bottom 0.254: v76.84,61.59 IC1.33
N$14  (via drill 0.6)
  Top 0.254: v106.05,57.15 62.23,57.15 59.05,60.32 v59.05,60.96
  Bottom 0.254: v106.05,57.15 106.05,34.92 106.68,34.29 R10.P$2 | v59.05,60.96 IC1.40
N$15  (via drill 0.6)
  Top 0.254: v80.64,58.1 62.87,58.1 61.59,59.37 v61.59,59.69
  Bottom 0.254: v80.64,58.1 80.64,43.81 79.38,42.55 79.38,34.92 80.01,34.29 R11.P$2 | v61.59,59.69 IC1.39
N$16  (via drill 0.6)
  Top 0.254: R12.P$2 53.34,32.38 54.61,31.11 59.69,31.11 v62.87,34.29
  Bottom 0.254: IC1.38 64.14,53.34 62.87,52.07 v62.87,34.29
N$17  (via drill 0.6)
  Top 0.254: v26.67,45.72 29.84,48.89 64.77,48.89 65.41,49.53 v65.41,53.34
  Bottom 0.254: R13.P$2 v26.67,45.72 | IC1.37 66.67,64.14 65.41,62.87 v65.41,53.34
N$18
  Top 0.254: IC1.4 66.67,52.07 67.94,53.34 104.14,53.34 107.95,57.15 107.95,59.05 111.12,62.23 111.12,64.14 111.76,64.77 J1.6
N$19
  Top 0.254: IC1.5 69.22,52.07 69.85,52.7 104.78,52.7 109.22,57.15 109.22,59.05 J1.5
N$20
  Top 0.254: IC1.18 102.23,50.16 105.41,46.99 107.95,46.99 110.49,49.53 110.49,51.44 111.12,52.07 J1.1
N$21
  Top 0.254: IC1.19 104.78,49.53 106.05,48.26 107.31,48.26 109.22,50.16 109.22,53.34 110.49,54.61 J1.2
N$22
  Top 0.254: IC1.20 107.31,53.34 111.12,57.15 J1.3
N$23
  Top 0.254: IC1.21 107.95,66.68 107.95,73.66 110.49,76.2 113.03,76.2 114.3,74.93 114.3,60.96 113.03,59.69 J1.4
N$24  (via drill 0.6)
  other vias: 14.15,42.37
N$25  (via drill 0.6)
  Top 0.254: IC1.17 99.7,49.53 103.5,45.72 v107.95,45.72
  Bottom 0.254: v107.95,45.72 107.95,38.73 112.39,34.29 JP1.1
N$26
  Bottom 2.032: 29.84,85.73 33.66,85.73
N$28
  Top 0.254: OK1.2 31.12,66.68 D1.C 28.58,69.22 R19.2
N$29
  Bottom 2.032: 22.23,85.73 26.04,85.73
N$30
  Top 0.254: R2.1 83.82,30.48 87.63,34.29 87.63,37.46 88.9,38.73 IC3.15
N$31
  Top 0.254: R3.1 81.76,31.6 83.67,31.6 87,34.92 87,38.1 88.9,40.01 95.89,40.01 97.16,41.27 IC3.1
N$33
  Top 0.254: R5.1 77.47,28.57 84.45,28.57 88.9,33.02 88.9,34.29 89.53,34.92 95.89,34.92 97.16,36.2 IC3.3
N$34
  Top 0.254: R6.1 75.56,27.94 85.09,27.94 89.53,32.38 95.89,32.38 97.16,33.66 IC3.4
N$35
  Top 0.254: R7.1 73.66,27.3 85.73,27.3 88.27,29.84 96.2,29.84 97.47,31.11 IC3.5
N$36
  Top 0.254: R9.1 66.04,30.48 70.48,26.04 88.27,26.04 89.53,24.77 93.34,24.77 94.61,26.04 IC3.7
N$37
  Top 0.254: R8.1 71.75,26.67 88.27,26.67 88.9,27.3 95.89,27.3 97.16,28.57 IC3.6
N$38
  Bottom 2.032: 42.55,85.73 46.36,85.73
N$39
  Bottom 2.032: 50.16,85.73 53.98,85.73
N$40
  Top 2.032: 22.23,85.73 26.04,85.73
N$41
  Top 2.032: 29.84,85.73 33.66,85.73
N$42
  Top 0.254: R2.2 83.82,22.22 98.11,22.22 100.33,20.32 LED1.A
N$43
  Top 0.254: R3.2 81.92,21.59 89.22,21.59 90.49,20.32 LED2.A
N$44
  Top 0.254: R4.2 80.01,20.95 87,20.95 LED3.A
N$45
  Top 0.254: LED4.A 75.56,22.54 R5.2
N$46
  Top 0.254: LED5.A 70.48,20.32 R6.2
N$47
  Top 0.254: R7.2 68.58,20.95 60.33,20.95 LED6.A
N$48
  Top 0.254: R8.2 66.67,21.59 58.42,21.59 57.15,20.32 LED7.A
N$49
  Top 0.254: R9.2 64.77,22.22 45.09,22.22 43.18,20.32 LED8.A
N$50
  Top 2.032: 42.55,85.73 46.36,85.73
N$51
  Top 2.032: 50.16,85.73 53.98,85.73
N$52
  Top 0.254: 6.98,17.14 6.98,17.78 | 6.98,17.14 6.98,15.88 | 6.98,15.88 6.98,13.34 | 6.98,13.34 6.98,12.7 | 6.35,13.34 4.45,13.34 | 6.98,13.34 6.35,13.34 | 6.35,13.34 6.35,14.61 5.71,15.24 5.08,15.24 4.45,14.61 | 6.98,17.14 4.45,17.14 3.81,16.51 3.17,17.14 3.17,17.78 3.81,18.41 | 6.98,15.88 4.45,15.88 | 6.98,15.88 7.62,15.88 8.25,15.24 8.25,13.97 7.62,13.34
N$53
  Bottom 0.254: 4.45,13.34 5.71,14.61 7.62,12.7 8.25,13.34 7.62,13.97 6.35,12.7
N$54
  Bottom 0.254: 6.98,15.24 6.98,14.61 | 6.98,15.24 6.98,16.51 | 6.98,16.51 6.98,19.05 | 6.98,19.05 6.98,19.68 | 6.35,19.05 4.45,19.05 | 6.98,19.05 6.35,19.05 | 6.35,19.05 6.35,17.78 5.71,17.14 5.08,17.14 4.45,17.78 | 6.98,15.24 4.45,15.24 3.81,15.88 3.17,15.24 3.17,14.61 3.81,13.97 | 6.98,16.51 4.45,16.51 | 6.98,16.51 7.62,16.51 8.25,17.14 8.25,18.41 7.62,19.05
N$57  (via drill 0.6)
  Top 0.254: U1.4 70.48,44.45 73.66,44.45 | 73.66,44.45 73.66,46.99 71.75,48.89 IC1.6 | 73.66,44.45 74.3,43.81 v88.27,43.81
  Bottom 0.254: IC3.14 89.53,36.2 88.27,37.46 v88.27,43.81
N$59  (via drill 0.6)
  Top 0.254: S1.2 104.09,14.66 104.14,14.61 102.23,12.7 v41.27,12.7 26.04,12.7 23.49,15.24 RN1.2
  Bottom 0.254: S1.2 S1.1 | IC2.4 41.27,33.66 40.01,32.38 40.01,13.34 40.64,12.7 v41.27,12.7
N$61  (via drill 0.6)
  Top 0.254: S3.1 76.15,3.17 69.16,10.16 v38.73,10.16 RN1.4
  Bottom 0.254: S3.1 S3.2 | IC2.14 36.2,36.2 38.73,33.66 v38.73,10.16
N$62  (via drill 0.6)
  Top 0.254: S4.1 62.18,3.17 56.46,8.89 v37.47,8.89 24.77,8.89 23.49,7.62 RN1.5
  Bottom 0.254: S4.1 S4.2 | IC2.13 36.2,33.66 38.1,31.75 38.1,11.43 37.47,10.8 v37.47,8.89
N$63  (via drill 0.6)
  Top 0.254: S5.1 48.21,3.17 43.76,7.62 v36.2,7.62 25.4,7.62 22.86,5.08 RN1.6
  Bottom 0.254: S5.1 S5.2 | IC2.12 36.2,31.11 37.47,29.84 37.47,12.07 36.83,11.43 36.83,10.16 36.2,9.53 v36.2,7.62
N$64
  Top 0.254: SW1.A 19.64,57.74 20.32,58.42 54.61,58.42 59.05,53.98 IC1.1
N$65
  Top 0.254: IC1.2 61.59,52.7 55.25,59.05 16.43,59.05 SW1.B
N$66
  Top 0.254: IC1.3 64.14,51.44 55.88,59.69 23.49,59.69 14.64,68.54 SW1.E
N$68
  Top 0.254: X2.4 40.01,69.85 40.01,66.04 40.64,65.41 45.09,65.41 R18.1
N$72
  Top 0.254: X1.4 22.86,69.85 27.3,65.41 R19.1
N$73
  Top 0.254: X1.5 36.2,69.85 36.2,64.77 35.56,64.14 OK1.3 31.12,64.14 D1.A
N$76
  Top 0.254: IC1.25 97.16,69.22 85.34,81.03 U$1.6
N$78
  Top 0.254: R21.2 106.68,76.84 99.06,76.84 93.09,82.81 U$1.3
N$79
  Top 0.254: R20.2 62.48,83.57 U$1.15
N$82
  Top 0.254: C7.2 94.61,46.35 Q1.1 91.31,46.48 89.53,48.26 IC1.13
N$83
  Top 0.254: C6.2 83.19,46.35 Q1.2 87,46.86 IC1.12
RXD  (via drill 0.6)
  Top 0.254: v92.08,55.24 91.44,55.88 60.96,55.88 56.52,60.32 51.44,60.32 | 51.44,60.32 R14.2 | 51.44,60.32 46.99,60.32 43.18,64.14 OK1.6
  Bottom 0.254: v92.08,55.24 IC1.14
SCL  (via drill 0.6)
  Top 0.254: v57.79,62.23 58.42,62.87 103.5,62.87 104.78,64.14 IC1.22 R16.2 | IC4.6 48.9,53.34 49.53,52.7 57.15,52.7 v57.79,53.34
  Bottom 0.254: v57.79,53.34 v57.79,62.23
SDA  (via drill 0.6)
  Top 0.254: v56.52,63.5 100.97,63.5 102.23,64.77 IC1.23 R15.2 | IC4.5 v56.52,54.61
  Bottom 0.254: v56.52,54.61 v56.52,63.5
SOUT
  Top 0.254: IC3.9 94.61,23.49 95.89,24.77 100.97,24.77 102.23,23.49 UI_EXP..1
TXD  (via drill 0.6)
  Top 0.254: X2.5 53.34,64.77 61.59,56.52 93.98,56.52 v94.61,55.88
  Bottom 0.254: v94.61,55.88 IC1.15
VCC  (via drill 0.6)
  Top 0.61: R16.1 R15.1
  Top 0.711: 90.81,43.18 90.17,43.18 arc37 88.9,42.55 arc-37 87.63,41.91 v78.11,41.91 73.66,41.91 73.02,41.27 66.67,41.27 | 90.81,43.18 IC3.16 | 95.25,85.09 60.33,85.09 arc90 51.44,76.2 R14.1 | U$1.2 95.5,84.84 arc90 95.25,85.09 | R16.1 arc90 106.05,79.38 106.05,81.28 | R14.1 R18.2 C1.1 OK1.8 | 106.05,81.28 R21.1 arc-93 110.49,79.38 arc93 J3.2 arc-93 115.57,74.3 arc3 115.57,49.67 115.57,46.99 | 95.25,85.09 97.79,85.09 arc-37 101.6,83.82 arc-16 102.87,82.55 arc53 106.05,81.28 | IC1.30 C8.1 arc90 81.28,73.03 74.93,73.03 arc9 74.3,73.03 arc-52 67.94,75.57 arc48 62.23,78.11 R20.1 56.52,78.11 arc90 51.44,73.03 R14.1 | 34.92,43.18 31.12,43.18 arc90 24.17,36.23 R13.P$1 24.13,34.25 24.13,19.68 arc-90 RN1.1 | 34.92,43.18 v40.64,43.18 43.82,43.18 arc-37 45.09,42.55 arc37 46.36,41.91 v51.44,41.91 61.59,41.91 | 61.59,41.91 64.77,41.91 65.41,41.27 66.67,41.27 | 90.81,43.18 99.06,43.18 | 99.06,43.18 C2.1 | 34.92,43.18 C3.1 | 34.92,43.18 IC2.16 | 66.67,41.27 U1.2 | 115.57,41.91 115.57,46.99 | 104.14,33.02 arc18 R10.P$1 arc-90 106.72,35.56 115.57,35.56 | 99.06,43.18 108.59,43.18 arc-37 109.86,42.55 arc37 111.12,41.91 115.57,41.91 | 115.57,46.99 J2.2 | 61.59,41.91 R1.2 | C5.1 arc-90 41.91,51.44 42.55,51.44 arc90 43.82,53.34 IC4.8 | 115.57,41.91 115.57,35.56 | 115.57,35.56 115.57,21.59 arc-90 J4.2 | IC1.10 81.28,49.53 arc-37 80.01,48.26 C9.1
  Bottom 0.254: IC3.10 92.08,26.04 92.71,26.67 92.71,40.64 92.08,41.27 IC3.16
  Bottom 0.711: IC1.10 81.92,60.32 arc-67 83.19,62.23 arc67 84.45,64.14 IC1.30 | R12.P$1 51.44,33.62 v51.44,41.91 | R11.P$1 78.11,33.62 v78.11,41.91 | v40.64,43.18 C5.1

### Text on the board
bPlace: GND | +5V | IN4> | IN3> | IN2> | IN1> | CV1< | CV2< | Q< | F< | VCA< | OSC< | GND | +5V | Edit 4 | Edit 3 | Edit 2 | Edit 1 | TX< | EN< | CLK< | Q7'< | GND | + | +5V | -
tNames: Mutable instruments | Control board v0.7 | Shruthi-1 | 6N137
bNames: Input expansion | Mutable instruments | Control board v0.7 | Shruthi-1 | 1 | Output expansion